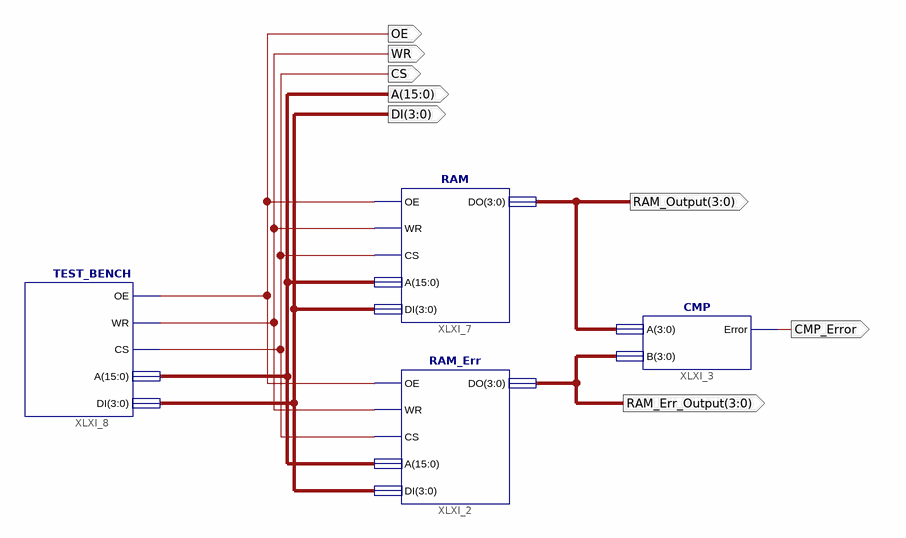
[diagram p0: schematic sheet 1]
// Xilinx ISE schematic TopLevel.sch (spartan3a) as structural Verilog: 4 symbols, 8 ports
module TopLevel (
  output [3:0] RAM_Err_Output,
  output [3:0] RAM_Output,
  output OE,
  output WR,
  output CS,
  output [15:0] A,
  output [3:0] DI,
  output CMP_Error
);

  RAM_Err XLXI_2 (.OE(OE), .WR(WR), .CS(CS), .A(A), .DI(DI), .DO(RAM_Err_Output));
  CMP XLXI_3 (.A(RAM_Output), .B(RAM_Err_Output), .Error(CMP_Error));
  RAM XLXI_7 (.OE(OE), .WR(WR), .CS(CS), .A(A), .DI(DI), .DO(RAM_Output));
  TEST_BENCH XLXI_8 (.OE(OE), .WR(WR), .CS(CS), .A(A), .DI(DI));
endmodule
